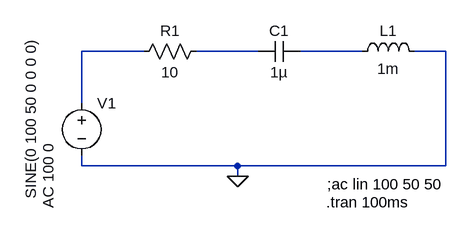
[diagram p0: schematic RLC Circuits (1) - Capacitive Circuit.asc]
RLC Circuits (1) - Capacitive Circuit.asc, the LTspice schematic file:
Version 4
SHEET 1 880 680
WIRE 16 96 -80 96
WIRE 192 96 96 96
WIRE 352 96 256 96
WIRE 480 96 432 96
WIRE -80 176 -80 96
WIRE -80 272 -80 256
WIRE 160 272 -80 272
WIRE 480 272 480 96
WIRE 480 272 160 272
WIRE 160 288 160 272
FLAG 160 288 0
SYMBOL voltage -80 160 R0
WINDOW 3 -78 -84 VRight 2
WINDOW 123 -51 77 VRight 2
WINDOW 39 0 0 Left 0
SYMATTR InstName V1
SYMATTR Value SINE(0 100 50 0 0 0 0)
SYMATTR Value2 AC 100 0
SYMBOL cap 256 80 R90
WINDOW 0 0 32 VBottom 2
WINDOW 3 32 32 VTop 2
SYMATTR InstName C1
SYMATTR Value 1µ
SYMBOL res 112 80 R90
WINDOW 0 0 56 VBottom 2
WINDOW 3 32 56 VTop 2
SYMATTR InstName R1
SYMATTR Value 10
SYMBOL ind 336 112 R270
WINDOW 0 32 56 VTop 2
WINDOW 3 5 56 VBottom 2
SYMATTR InstName L1
SYMATTR Value 1m
TEXT 298 300 Left 2 !;ac lin 100 50 50
TEXT 296 328 Left 2 !.tran 100ms

The netlist it stands for:
* RLC Circuits (1) - Capacitive Circuit.asc
V1 N001 0 SINE(0 100 50 0 0 0 0) AC 100 0
C1 N003 N002 1µ
R1 N002 N001 10
L1 N003 0 1m
;ac lin 100 50 50
.tran 100ms
.backanno
.end